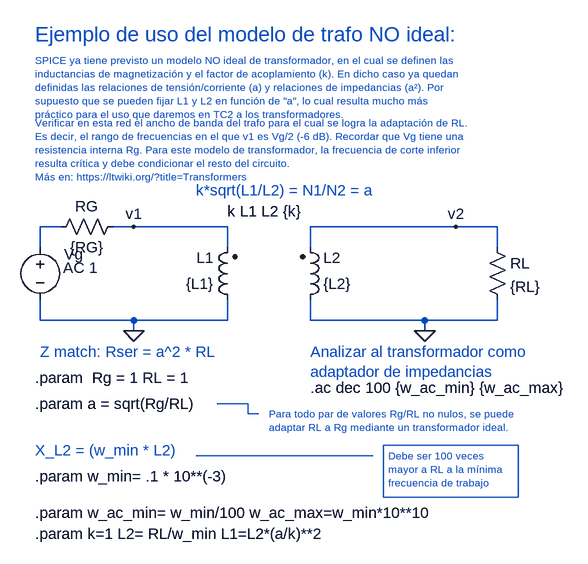
[diagram p0: schematic trafo no ideal ej1.asc]
trafo no ideal ej1.asc, the LTspice schematic file:
Version 4
SHEET 1 1284 680
WIRE -80 96 -112 96
WIRE 32 96 0 96
WIRE 176 96 32 96
WIRE 528 96 304 96
WIRE 592 96 528 96
WIRE -112 128 -112 96
WIRE 176 128 176 96
WIRE 304 128 304 96
WIRE 592 128 592 96
WIRE -112 240 -112 208
WIRE 32 240 -112 240
WIRE 176 240 176 208
WIRE 176 240 32 240
WIRE 304 240 304 208
WIRE 480 240 304 240
WIRE 592 240 592 208
WIRE 592 240 480 240
WIRE 32 256 32 240
WIRE 480 256 480 240
FLAG 32 256 0
FLAG 528 96 v2
FLAG 32 96 v1
FLAG 480 256 0
SYMBOL voltage -112 112 R0
WINDOW 0 37 26 Left 2
WINDOW 123 35 47 Left 2
WINDOW 3 -91 218 Invisible 2
SYMATTR InstName Vg
SYMATTR Value2 AC 1
SYMATTR Value ""
SYMBOL res 576 112 R0
SYMATTR InstName RL
SYMATTR Value {RL}
SYMBOL ind2 192 224 R180
WINDOW 0 36 80 Left 2
WINDOW 3 36 40 Left 2
SYMATTR InstName L1
SYMATTR Value {L1}
SYMATTR Type ind
SYMATTR SpiceLine Rser=0
SYMBOL ind2 288 224 M180
WINDOW 0 36 80 Left 2
WINDOW 3 36 40 Left 2
SYMATTR InstName L2
SYMATTR Value {L2}
SYMATTR Type ind
SYMATTR SpiceLine Rser=0
SYMBOL res 16 80 R90
WINDOW 0 0 56 VBottom 2
WINDOW 3 32 56 VTop 2
SYMATTR InstName RG
SYMATTR Value {RG}
TEXT -120 368 Left 2 !.param a = sqrt(Rg/RL)
TEXT -112 288 Left 2 ;Z match: Rser = a^2 * RL
TEXT -120 328 Left 2 !.param  Rg = 1 RL = 1
TEXT 304 344 Left 2 !.ac dec 100 {w_ac_min} {w_ac_max}
TEXT -120 -160 Left 1 ;SPICE ya tiene previsto un modelo NO ideal de transformador, en el cual se definen las \ninductancias de magnetización y el factor de acoplamiento (k). En dicho caso ya quedan\ndefinidas las relaciones de tensión/corriente (a) y relaciones de impedancias (a²). Por \nsupuesto que se pueden fijar L1 y L2 en función de "a", lo cual resulta mucho más \npráctico para el uso que daremos en TC2 a los transformadores.
TEXT -120 -200 Left 3 ;Ejemplo de uso del modelo de trafo NO ideal:
TEXT 240 384 Left 1 ;Para todo par de valores Rg/RL no nulos, se puede \nadaptar RL a Rg mediante un transformador ideal.
TEXT -120 568 Left 2 !.param k=1 L2= RL/w_min L1=L2*(a/k)**2
TEXT -120 440 Left 2 ;X_L2 = (w_min * L2)
TEXT 424 448 Left 1 ;Debe ser 100 veces \nmayor a RL a la mínima \nfrecuencia de trabajo
TEXT 176 72 Left 2 !k L1 L2 {k}
TEXT 128 40 Left 2 ;k*sqrt(L1/L2) = N1/N2 = a
TEXT 304 288 Left 2 ;Analizar al transformador como \nadaptador de impedancias
TEXT -120 480 Left 2 !.param w_min= .1 * 10**(-3)
TEXT -120 536 Left 2 !.param w_ac_min= w_min/100 w_ac_max=w_min*10**10
TEXT -120 -64 Left 1 ;Verificar en esta red el ancho de banda del trafo para el cual se logra la adaptación de RL. \nEs decir, el rango de frecuencias en el que v1 es Vg/2 (-6 dB). Recordar que Vg tiene una \nresistencia interna Rg. Para este modelo de transformador, la frecuencia de corte inferior \nresulta crítica y debe condicionar el resto del circuito. \nMás en: https://ltwiki.org/?title=Transformers
LINE Normal 400 448 128 448
LINE Normal 208 384 224 384
LINE Normal 208 368 208 384
LINE Normal 160 368 208 368
RECTANGLE Normal 624 512 416 432

The netlist it stands for:
* trafo no ideal ej1.asc
Vg N001 0 AC 1
RL v2 0 {RL}
L1 0 v1 {L1} Rser=0
L2 0 v2 {L2} Rser=0
RG v1 N001 {RG}
.param a = sqrt(Rg/RL)
* Z match: Rser = a^2 * RL
.param  Rg = 1 RL = 1
.ac dec 100 {w_ac_min} {w_ac_max}
* SPICE ya tiene previsto un modelo NO ideal de transformador, en el cual se definen las
* inductancias de magnetización y el factor de acoplamiento (k). En dicho caso ya quedan
* definidas las relaciones de tensión/corriente (a) y relaciones de impedancias (a²). Por
* supuesto que se pueden fijar L1 y L2 en función de "a", lo cual resulta mucho más
* práctico para el uso que daremos en TC2 a los transformadores.
* Ejemplo de uso del modelo de trafo NO ideal:
* Para todo par de valores Rg/RL no nulos, se puede
* adaptar RL a Rg mediante un transformador ideal.
.param k=1 L2= RL/w_min L1=L2*(a/k)**2
* X_L2 = (w_min * L2)
* Debe ser 100 veces
* mayor a RL a la mínima
* frecuencia de trabajo
k L1 L2 {k}
* k*sqrt(L1/L2) = N1/N2 = a
* Analizar al transformador como
* adaptador de impedancias
.param w_min= .1 * 10**(-3)
.param w_ac_min= w_min/100 w_ac_max=w_min*10**10
* Verificar en esta red el ancho de banda del trafo para el cual se logra la adaptación de RL.
* Es decir, el rango de frecuencias en el que v1 es Vg/2 (-6 dB). Recordar que Vg tiene una
* resistencia interna Rg. Para este modelo de transformador, la frecuencia de corte inferior
* resulta crítica y debe condicionar el resto del circuito.
* Más en: https://ltwiki.org/?title=Transformers
.backanno
.end